# EAGLE design Power_Buggy_4Coil_V1.1 (EAGLE 9.2.2)
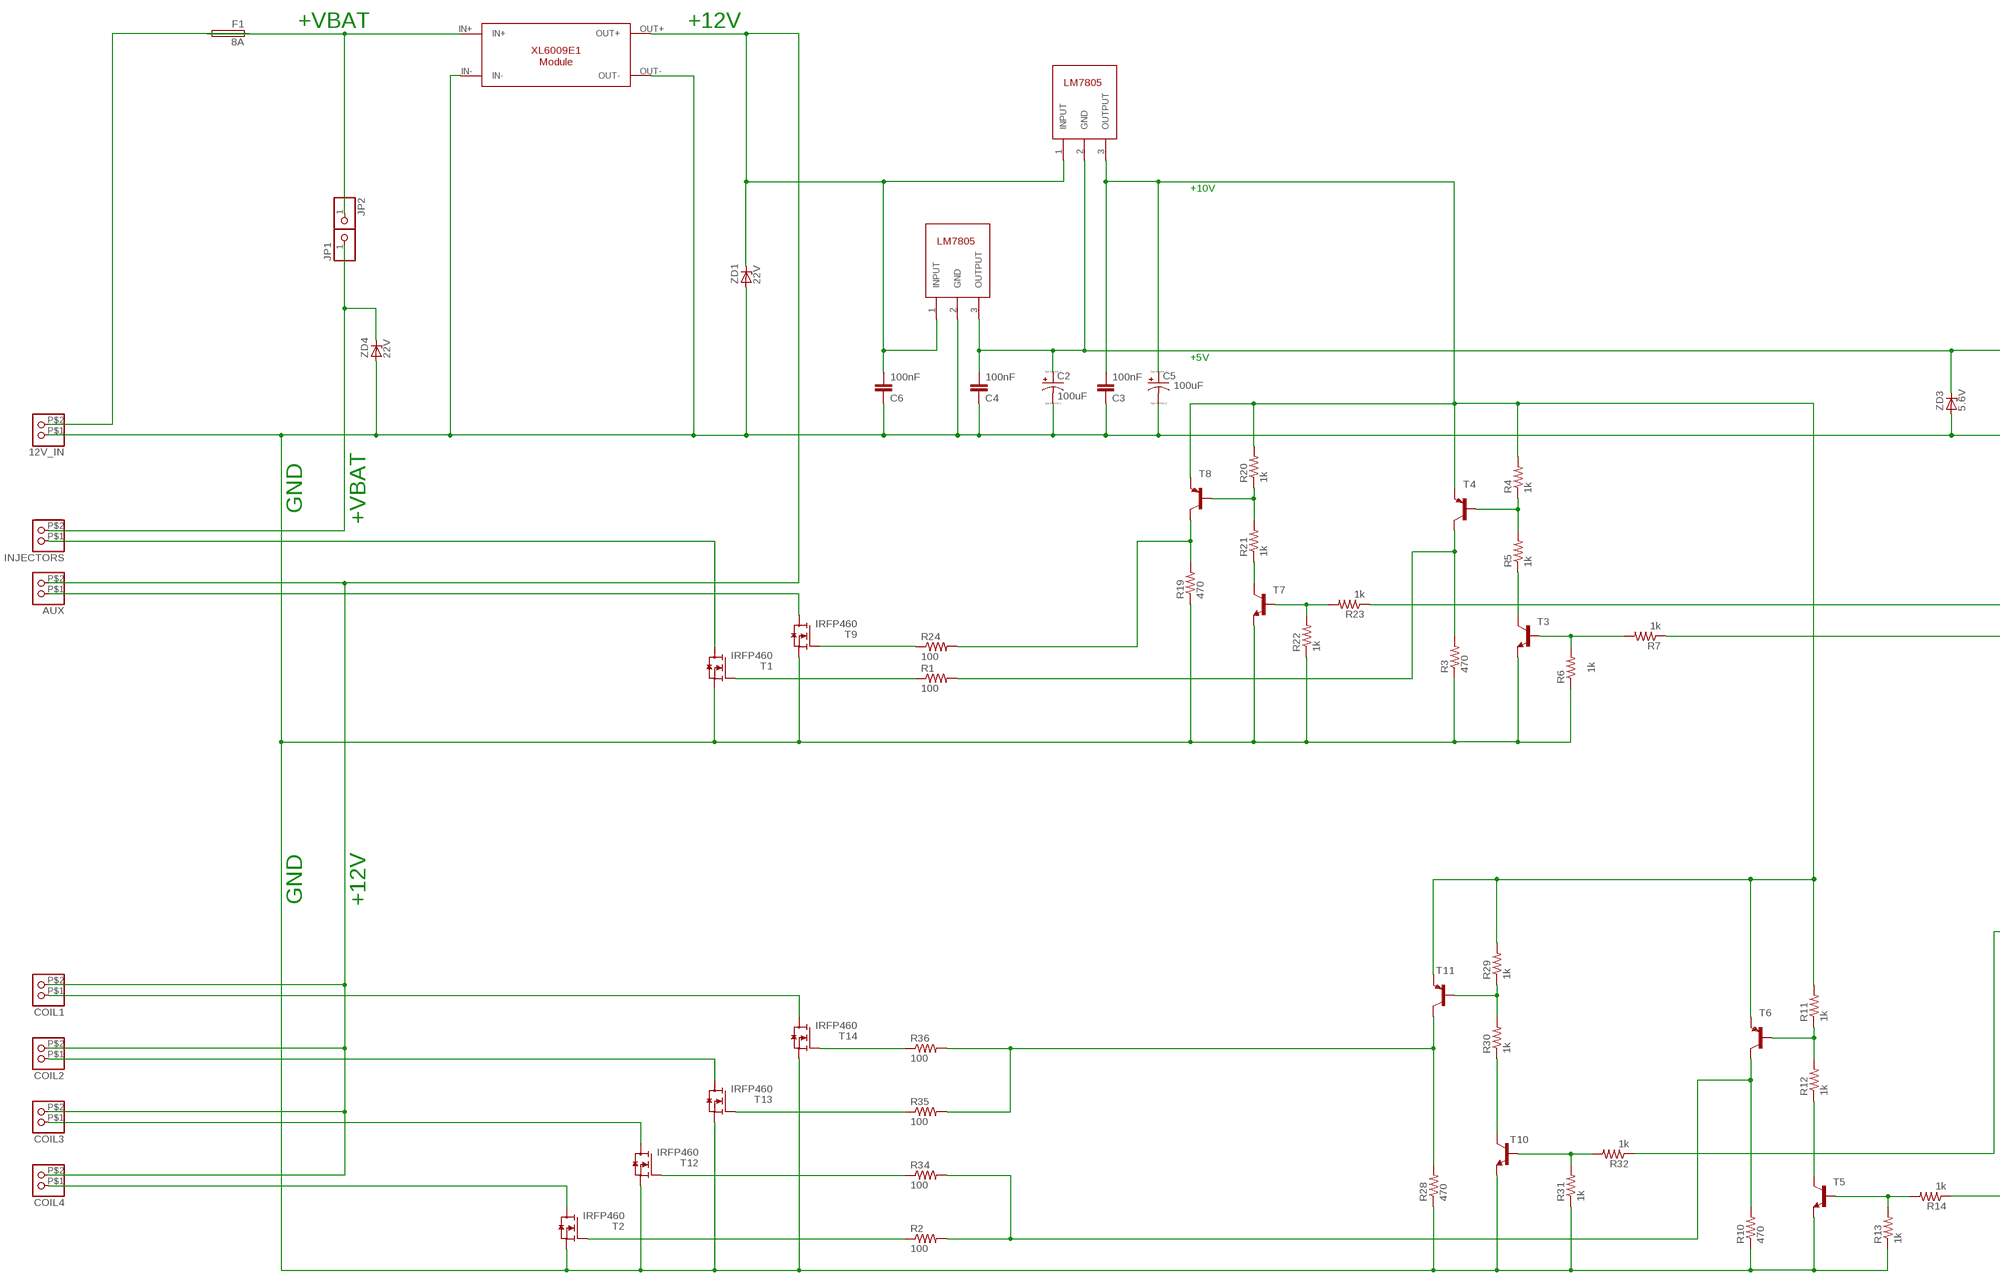
[diagram p0: schematic, sheet 1, part 1 of 2]
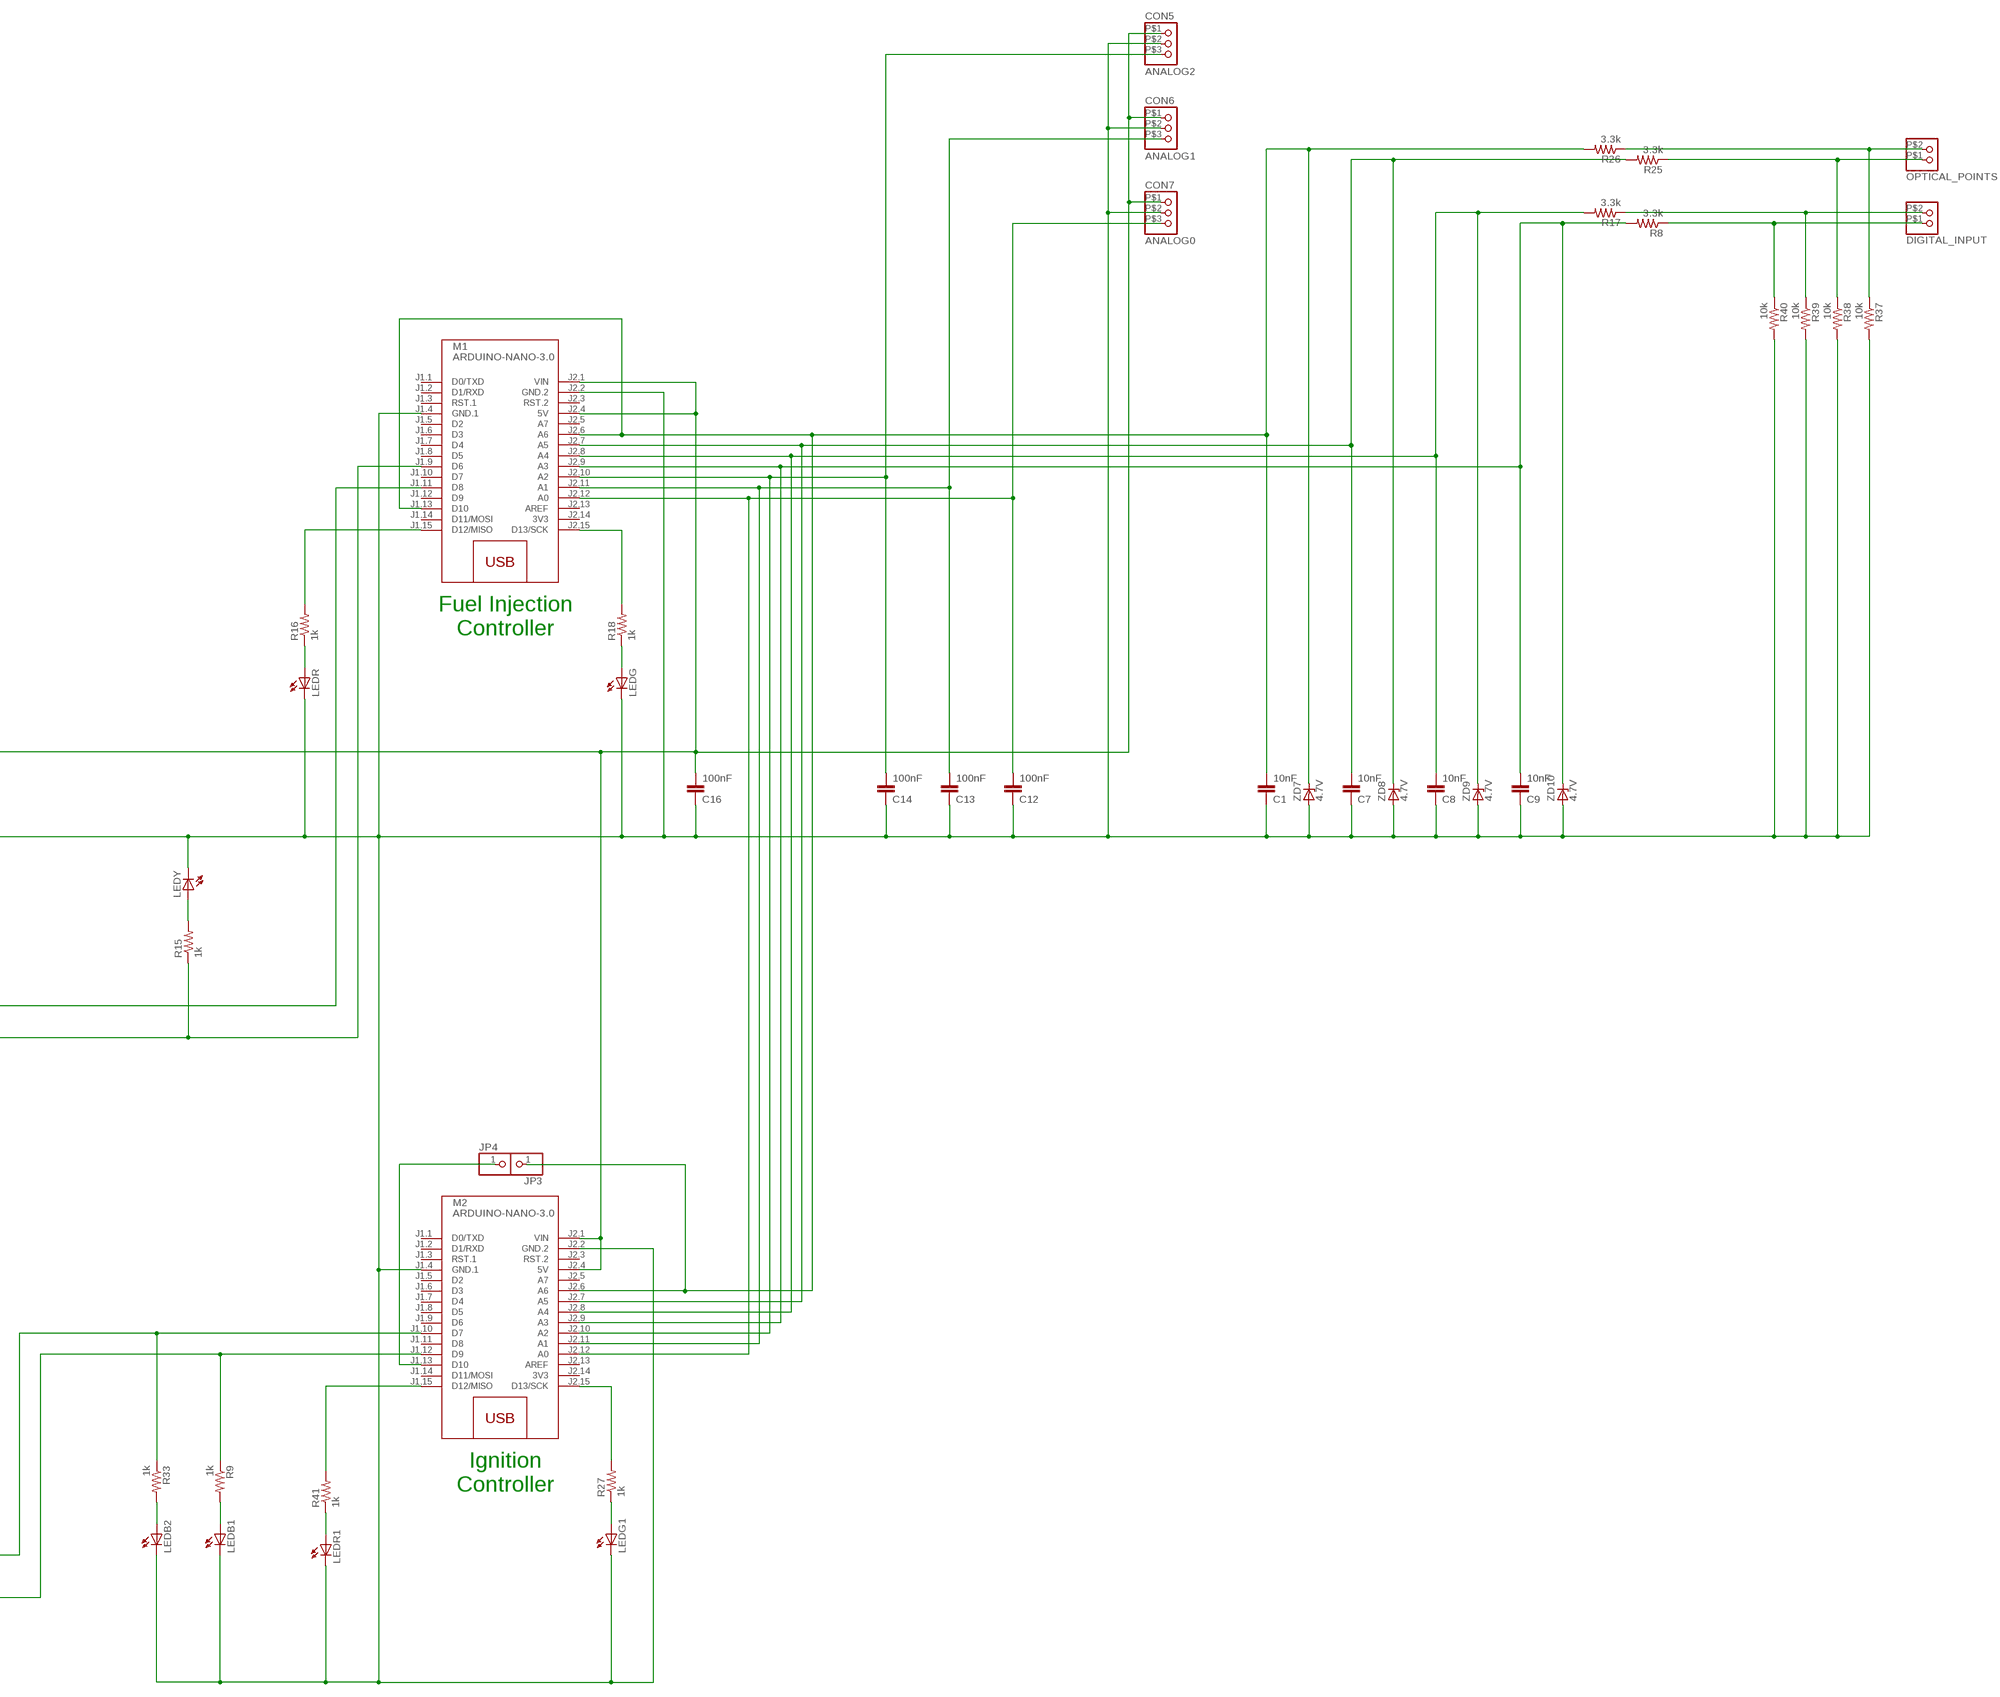
[diagram p1: schematic, sheet 1, part 2 of 2]

## Parts
12V_IN  EBBA-02-C-SS-BU  [EBBA-02-C-SS-BU]
AUX  EBBA-02-C-SS-BU  [EBBA-02-C-SS-BU]
C1  10nF  C-EU050-025X075  [C050-025X075]
C2  100uF  CPOL-USE2-5  [E2-5]
C3  100nF  C-EU050-025X075  [C050-025X075]
C4  100nF  C-EU050-025X075  [C050-025X075]
C5  100uF  CPOL-USE2-5  [E2-5]
C6  100nF  C-EU050-025X075  [C050-025X075]
C7  10nF  C-EU050-025X075  [C050-025X075]
C8  10nF  C-EU050-025X075  [C050-025X075]
C9  10nF  C-EU050-025X075  [C050-025X075]
C12  100nF  C-EU050-025X075  [C050-025X075]
C13  100nF  C-EU050-025X075  [C050-025X075]
C14  100nF  C-EU050-025X075  [C050-025X075]
C16  100nF  C-EU050-025X075  [C050-025X075]
COIL1  EBBA-02-C-SS-BU  [EBBA-02-C-SS-BU]
COIL2  EBBA-02-C-SS-BU  [EBBA-02-C-SS-BU]
COIL3  EBBA-02-C-SS-BU  [EBBA-02-C-SS-BU]
COIL4  EBBA-02-C-SS-BU  [EBBA-02-C-SS-BU]
CON5  ANALOG2  2.0MM_X3  [2.0MM_X3]
CON6  ANALOG1  2.0MM_X3  [2.0MM_X3]
CON7  ANALOG0  2.0MM_X3  [2.0MM_X3]
DIGITAL_INPUT  EBBA-02-C-SS-BU  [EBBA-02-C-SS-BU]
F1  8A  GSH15  [GSH15]
INJECTORS  EBBA-02-C-SS-BU  [EBBA-02-C-SS-BU]
JP1  PINHD-1X1  [1X01]
JP2  PINHD-1X1  [1X01]
JP3  PINHD-1X1  [1X01]
JP4  PINHD-1X1  [1X01]
LEDB1  LED3MM  [LED3MM]
LEDB2  LED3MM  [LED3MM]
LEDG  LED3MM  [LED3MM]
LEDG1  LED3MM  [LED3MM]
LEDR  LED3MM  [LED3MM]
LEDR1  LED3MM  [LED3MM]
LEDY  LED3MM  [LED3MM]
M1  ARDUINO-NANO-3.0  [ARDUINO-NANO-3.0]
M2  ARDUINO-NANO-3.0  [ARDUINO-NANO-3.0]
OPTICAL_POINTS  EBBA-02-C-SS-BU  [EBBA-02-C-SS-BU]
R1  100  R-US_0207/10  [0207/10]
R2  100  R-US_0207/10  [0207/10]
R3  470  R-US_0207/10  [0207/10]
R4  1k  R-US_0207/10  [0207/10]
R5  1k  R-US_0207/10  [0207/10]
R6  1k  R-US_0207/10  [0207/10]
R7  1k  R-US_0207/10  [0207/10]
R8  3.3k  R-US_0207/10  [0207/10]
R9  1k  R-US_0207/10  [0207/10]
R10  470  R-US_0207/10  [0207/10]
R11  1k  R-US_0207/10  [0207/10]
R12  1k  R-US_0207/10  [0207/10]
R13  1k  R-US_0207/10  [0207/10]
R14  1k  R-US_0207/10  [0207/10]
R15  1k  R-US_0207/10  [0207/10]
R16  1k  R-US_0207/10  [0207/10]
R17  3.3k  R-US_0207/10  [0207/10]
R18  1k  R-US_0207/10  [0207/10]
R19  470  R-US_0207/10  [0207/10]
R20  1k  R-US_0207/10  [0207/10]
R21  1k  R-US_0207/10  [0207/10]
R22  1k  R-US_0207/10  [0207/10]
R23  1k  R-US_0207/10  [0207/10]
R24  100  R-US_0207/10  [0207/10]
R25  3.3k  R-US_0207/10  [0207/10]
R26  3.3k  R-US_0207/10  [0207/10]
R27  1k  R-US_0207/10  [0207/10]
R28  470  R-US_0207/10  [0207/10]
R29  1k  R-US_0207/10  [0207/10]
R30  1k  R-US_0207/10  [0207/10]
R31  1k  R-US_0207/10  [0207/10]
R32  1k  R-US_0207/10  [0207/10]
R33  1k  R-US_0207/10  [0207/10]
R34  100  R-US_0207/10  [0207/10]
R35  100  R-US_0207/10  [0207/10]
R36  100  R-US_0207/10  [0207/10]
R37  10k  R-US_0207/10  [0207/10]
R38  10k  R-US_0207/10  [0207/10]
R39  10k  R-US_0207/10  [0207/10]
R40  10k  R-US_0207/10  [0207/10]
R41  1k  R-US_0207/10  [0207/10]
REG1  LM7805_VERT  [TO220_VERT]
REG2  LM7805_VERT  [TO220_VERT]
T1  IRFP460  MOSFET_VERT  [TO-247_HORIZONTAL]
T2  IRFP460  MOSFET_VERT  [TO-247_HORIZONTAL]
T3  -NPN-TO92-EBC  [TO92-EBC]
T4  BCX58-PNP-TO92-EBC  [TO92-EBC]
T5  -NPN-TO92-EBC  [TO92-EBC]
T6  BCX58-PNP-TO92-EBC  [TO92-EBC]
T7  -NPN-TO92-EBC  [TO92-EBC]
T8  BCX58-PNP-TO92-EBC  [TO92-EBC]
T9  IRFP460  MOSFET_VERT  [TO-247_HORIZONTAL]
T10  -NPN-TO92-EBC  [TO92-EBC]
T11  BCX58-PNP-TO92-EBC  [TO92-EBC]
T12  IRFP460  MOSFET_VERT  [TO-247_HORIZONTAL]
T13  IRFP460  MOSFET_VERT  [TO-247_HORIZONTAL]
T14  IRFP460  MOSFET_VERT  [TO-247_HORIZONTAL]
U$2  XL6009E1_MOD  [XL6009E1_MOD]
ZD1  22V  1N5333  [C1702-15]
ZD3  5.6V  1N5333  [C1702-15]
ZD4  22V  1N5333  [C1702-15]
ZD7  4.7V  1N4728  [DO41Z10]
ZD8  4.7V  1N4728  [DO41Z10]
ZD9  4.7V  1N4728  [DO41Z10]
ZD10  4.7V  1N4728  [DO41Z10]

## Nets
N$1: R19.2 R24.2 T8.C
N$2: AUX.P$2 C6.2 COIL1.P$2 COIL2.P$2 COIL3.P$2 COIL4.P$2 REG1.1(INPUT) REG2.1(INPUT) U$2.OUT+ ZD1.C
N$3: 12V_IN.P$1 C1.1 C2.- C3.1 C4.1 C5.- C6.1 C7.1 C8.1 C9.1 C12.1 C13.1 C14.1 C16.1 CON5.P$2 CON6.P$2 CON7.P$2 LEDB1.K(C) LEDB2.K(C) LEDG1.K(C) LEDG.K(C) LEDR1.K(C) LEDR.K(C) LEDY.K(C) M1.J1.4(GND.1) M1.J2.2(GND.2) M2.J1.4(GND.1) M2.J2.2(GND.2) R3.1 R6.1 R10.1 R13.1 R19.1 R22.1 R28.1 R31.1 R37.2 R38.2 R39.2 R40.2 REG1.2(GND) T1.S T2.S T3.E T5.E T7.E T9.S T10.E T12.S T13.S T14.S U$2.IN- U$2.OUT- ZD1.A ZD3.A ZD4.A ZD7.A ZD8.A ZD9.A ZD10.A
N$4: C2.+ C4.2 C16.2 CON5.P$1 CON6.P$1 CON7.P$1 M1.J2.1(VIN) M1.J2.4(5V) M2.J2.1(VIN) M2.J2.4(5V) REG1.3(OUTPUT) REG2.2(GND) ZD3.C
N$5: INJECTORS.P$1 T1.D
N$6: C3.2 C5.+ R4.2 R11.2 R20.2 R29.2 REG2.3(OUTPUT) T4.E T6.E T8.E T11.E
N$7: R28.2 R35.2 R36.2 T11.C
N$8: R2.1 T2.G
N$9: R1.1 T1.G
N$10: R1.2 R3.2 T4.C
N$11: R5.1 T3.C
N$12: R6.2 R7.2 T3.B
N$13: R4.1 R5.2 T4.B
N$14: M1.J1.9(D6) R7.1 R15.1
N$15: R20.1 R21.2 T8.B
N$16: R29.1 R30.2 T11.B
N$17: INJECTORS.P$2 JP1.1 ZD4.C
N$18: F1.2 JP2.1 U$2.IN+
N$19: R2.2 R10.2 R34.2 T6.C
N$20: M1.J1.15(D12/MISO) R16.2
N$21: R11.1 R12.2 T6.B
N$22: 12V_IN.P$2 F1.1
N$23: R12.1 T5.C
N$24: LEDR.A R16.1
N$25: M1.J2.15(D13/SCK) R18.2
N$26: LEDG.A R18.1
N$27: C9.2 M1.J2.9(A3) M2.J2.9(A3) R8.2 ZD10.C
N$28: OPTICAL_POINTS.P$1 R25.1 R38.1
N$29: LEDY.A R15.2
N$30: LEDB1.A R9.2
N$31: R21.1 T7.C
N$33: R22.2 R23.2 T7.B
N$34: C12.2 CON7.P$3 M1.J2.12(A0) M2.J2.12(A0)
N$35: R13.2 R14.2 T5.B
N$36: M1.J1.11(D8) R23.1
N$37: C13.2 CON6.P$3 M1.J2.11(A1) M2.J2.11(A1)
N$38: R24.1 T9.G
N$39: AUX.P$1 T9.D
N$40: C8.2 M1.J2.8(A4) M2.J2.8(A4) R17.2 ZD9.C
N$41: C7.2 M1.J2.7(A5) M2.J2.7(A5) R25.2 ZD8.C
N$42: C1.2 JP3.1 M1.J1.13(D10) M1.J2.6(A6) M2.J2.6(A6) R26.2 ZD7.C
N$43: OPTICAL_POINTS.P$2 R26.1 R37.1
N$44: DIGITAL_INPUT.P$1 R8.1 R40.1
N$45: DIGITAL_INPUT.P$2 R17.1 R39.1
N$46: M2.J2.15(D13/SCK) R27.2
N$47: LEDG1.A R27.1
N$48: R30.1 T10.C
N$49: R31.2 R32.2 T10.B
N$50: C14.2 CON5.P$3 M1.J2.10(A2) M2.J2.10(A2)
N$51: M2.J1.10(D7) R32.1 R33.1
N$52: LEDB2.A R33.2
N$53: M2.J1.12(D9) R9.1 R14.1
N$54: R34.1 T12.G
N$55: R35.1 T13.G
N$56: R36.1 T14.G
N$57: COIL4.P$1 T2.D
N$58: COIL3.P$1 T12.D
N$59: COIL2.P$1 T13.D
N$60: COIL1.P$1 T14.D
N$61: M2.J1.15(D12/MISO) R41.2
N$62: LEDR1.A R41.1
N$63: JP4.1 M2.J1.13(D10)
Unconnected: M1.J1.1(D0/TXD) M1.J1.2(D1/RXD) M1.J1.3(RST.1) M1.J1.5(D2) M1.J1.6(D3) M1.J1.7(D4) M1.J1.8(D5) M1.J1.10(D7) M1.J1.12(D9) M1.J1.14(D11/MOSI) M1.J2.3(RST.2) M1.J2.5(A7) M1.J2.13(AREF) M2.J1.1(D0/TXD) M2.J1.2(D1/RXD) M2.J1.3(RST.1) M2.J1.5(D2) M2.J1.6(D3) M2.J1.7(D4) M2.J1.8(D5) M2.J1.9(D6) M2.J1.11(D8) M2.J1.14(D11/MOSI) M2.J2.3(RST.2) M2.J2.5(A7) M2.J2.13(AREF)

## Notes on the sheet
- +VBAT | +12V
- +10V
- Fuel Injection
  Controller
- +5V
- GND | +VBAT
- GND | +12V
- Ignition
  Controller

## Power pins joined to a net without a drawn wire
3V3: M1.J2.14(3V3) M2.J2.14(3V3)

## Library data of the parts
12V_IN AUX COIL1-COIL4 DIGITAL_INPUT INJECTORS OPTICAL_POINTS = Portable_Cal_Parts_SM:EBBA-02-C-SS-BU
C1 C3 C4 C6-C9 C12-C14 C16 = resistor:C-EU: CAPACITOR, European symbol
C2 C5 = resistor:CPOL-US: POLARIZED CAPACITOR, American symbol
CON5-CON7 = Power_Buggy_Parts:2.0MM_X3
F1 = fuse:GSH15: FUSE HOLDER grid 15mm, 19649 Wickmann; MPN: 64900001039; OC_FARNELL: 1271673; OC_NEWARK: 02P0318
JP1-JP4 = pinhead:PINHD-1X1: PIN HEADER
LEDB1 LEDB2 LEDG LEDG1 LEDR LEDR1 LEDY = led:LED: LED OSRAM: - CHIPLED LG R971, LG N971, LY N971, LG Q971, LY Q971, LO R971, LY R971 LH N974, LH R974 LS Q976, LO Q976, LY Q976 LO Q996 - Hyper CHIPLED LW Q18S LB Q993, LB Q99A, LB R99A - SideLED LS A670, LO A670, LY A670, LG A670, LP A670 LB A673, LV A673, LT A673, LW A673 LH A674 LY A675 LS A676, LA A676, LO A676, LY A676, LW A676 LS A679, LY A679, LG A679 - Hyper Micro SIDELED® LS Y876, LA Y876, LO Y876, LY Y876 LT Y87S - SmartLED LW L88C, LW L88S LB L89C, LB L89S, LG L890 LS L89K, LO L89K, LY L89K LS L896, LA L896, LO L896, LY L896 - TOPLED LS T670, LO T670, LY T670, LG T670, LP T670 LSG T670, LSP T670, LSY T670, LOP T670, LYG T670 LG T671, LOG T671, LSG T671 LB T673, LV T673, LT T673, LW T673 LH T674 LS T676, LA T676, LO T676, LY T676, LB T676, LH T676, LSB T676, LW T676 LB T67C, LV T67C, LT T67C, LS T67K, LO T67K, LY T67K, LW E67C LS E67B, LA E67B, LO E67B, LY E67B, LB E67C, LV E67C, LT E67C LW T67C LS T679, LY T679, LG T679 LS T770, LO T770, LY T770, LG T770, LP T770 LB T773, LV T773, LT T773, LW T773 LH T774 LS E675, LA E675, LY E675, LS T675 LS T776, LA T776, LO T776, LY T776, LB T776 LHGB T686 LT T68C, LB T68C - Hyper Mini TOPLED® LB M676 - Mini TOPLED Santana® LG M470 LS M47K, LO M47K, LY M47K Source: http://www.osram.convergy.de LUXEON: - LUMILED® LXK2-PW12-R00, LXK2-PW12-S00, LXK2-PW14-U00, LXK2-PW14-V00 LXK2-PM12-R00, LXK2-PM12-S00, LXK2-PM14-U00 LXK2-PE12-Q00, LXK2-PE12-R00, LXK2-PE12-S00, LXK2-PE14-T00, LXK2-PE14-U00 LXK2-PB12-K00, LXK2-PB12-L00, LXK2-PB12-M00, LXK2-PB14-N00, LXK2-PB14-P00, LXK2-PB14-Q00 LXK2-PR12-L00, LXK2-PR12-M00, LXK2-PR14-Q00, LXK2-PR14-R00 LXK2-PD12-Q00, LXK2-PD12-R00, LXK2-PD12-S00 LXK2-PH12-R00, LXK2-PH12-S00 LXK2-PL12-P00, LXK2-PL12-Q00, LXK2-PL12-R00 Source: www.luxeon.com KINGBRIGHT: KA-3528ASYC Source: www.kingbright.com
M1 M2 = diy-modules:ARDUINO-NANO-3.0: Arduino Nano 3.0
R1-R41 = resistor:R-US_: RESISTOR, American symbol
REG1 REG2 = Portable_Cal_Parts_SM:LM7805_VERT
T1 T2 T9 T12-T14 = Inverter_Parts:MOSFET_VERT
T3 T5 T7 T10 = transistor-neu-to92:*-NPN-: NPN Transistror
T4 T6 T8 T11 = transistor:*-PNP-: PNP Transistror
U$2 = Power_Buggy_Parts:XL6009E1_MOD
ZD1 ZD3 ZD4 = diode:1N5333: Z DIODE 3.3 V, 5W, 5 percent (Motorola)
ZD7-ZD10 = diode:1N4728: Z DIODE 3.3 V, 1W, 5 percent

## Board
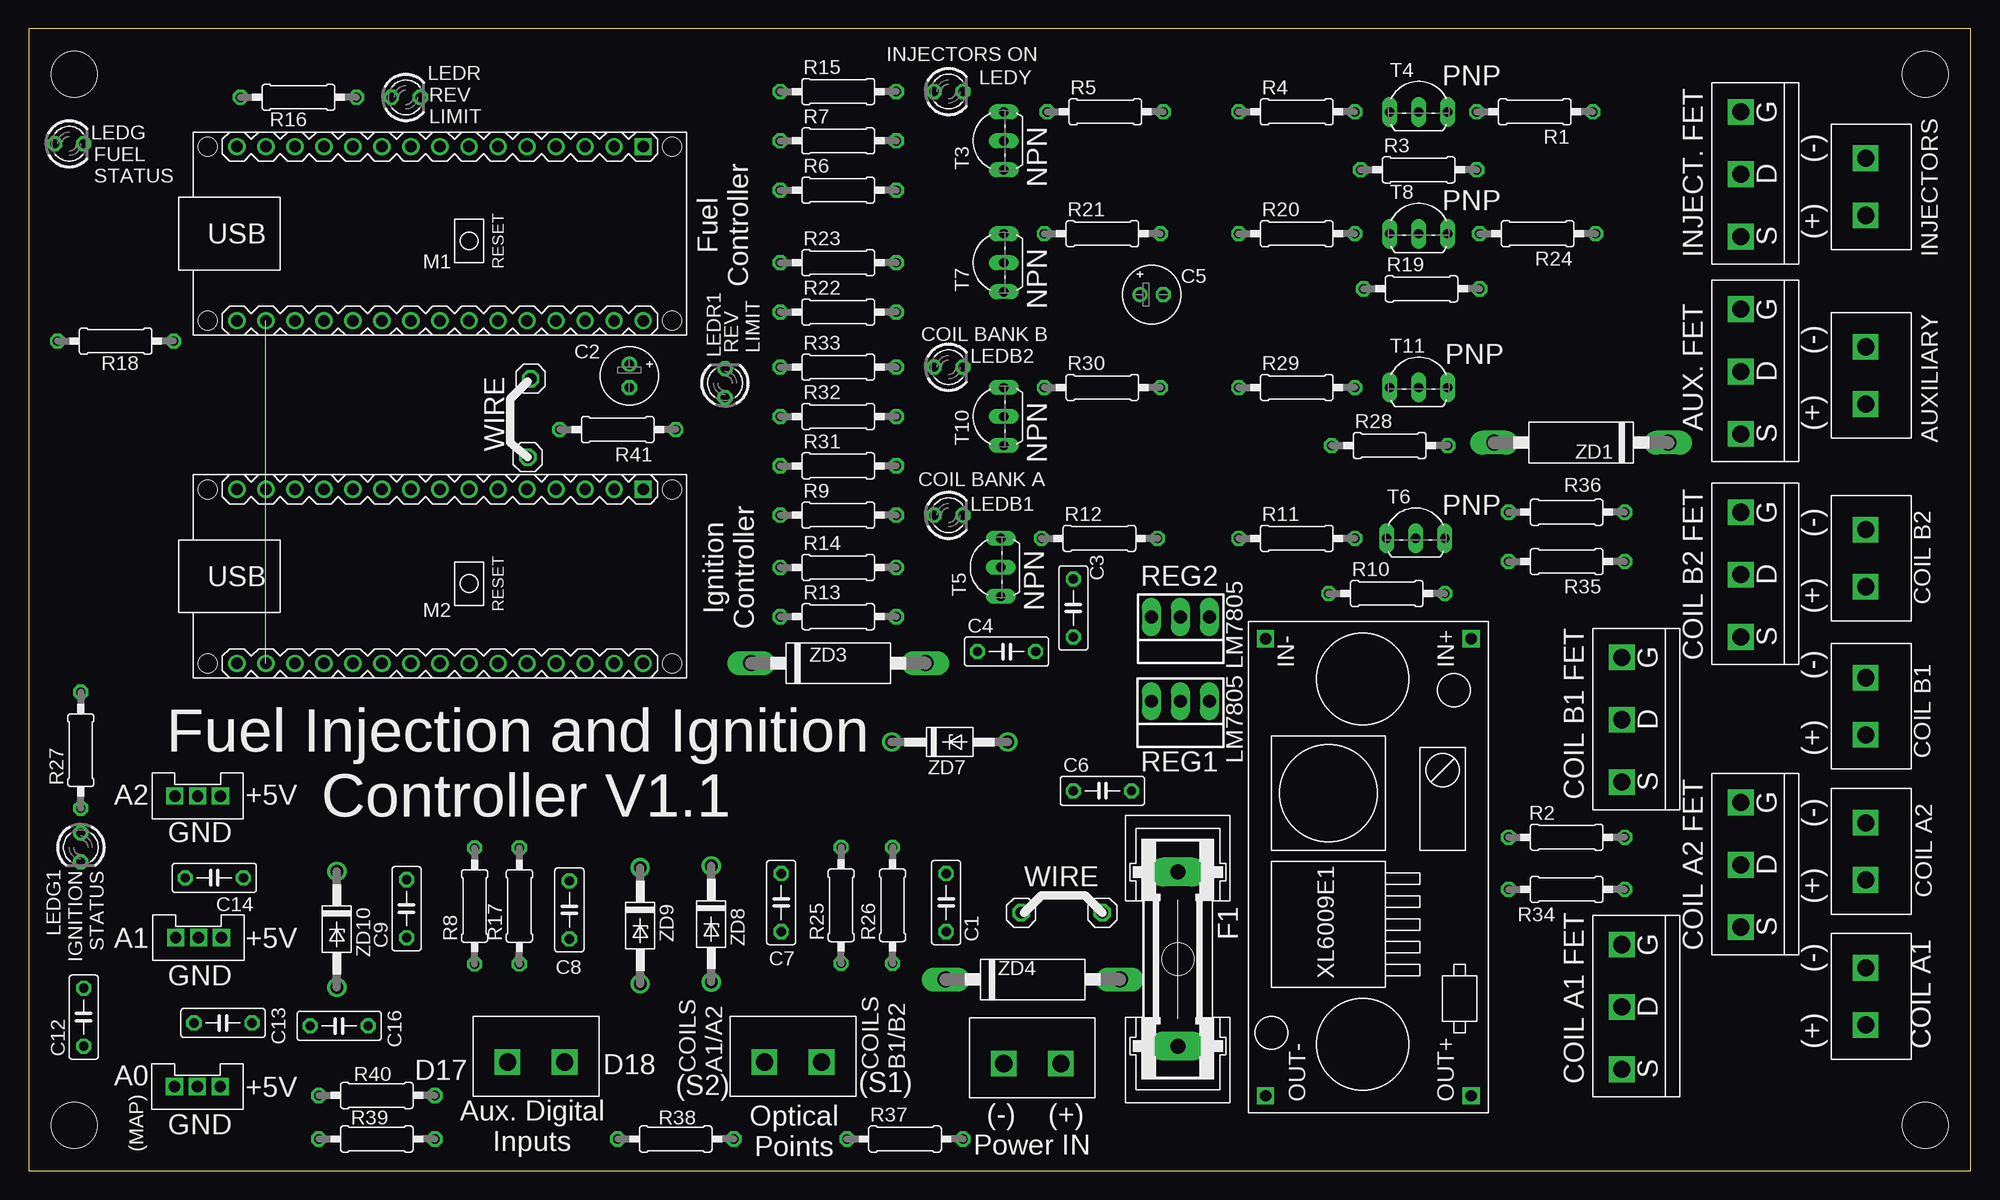
[diagram p2: board, top side]
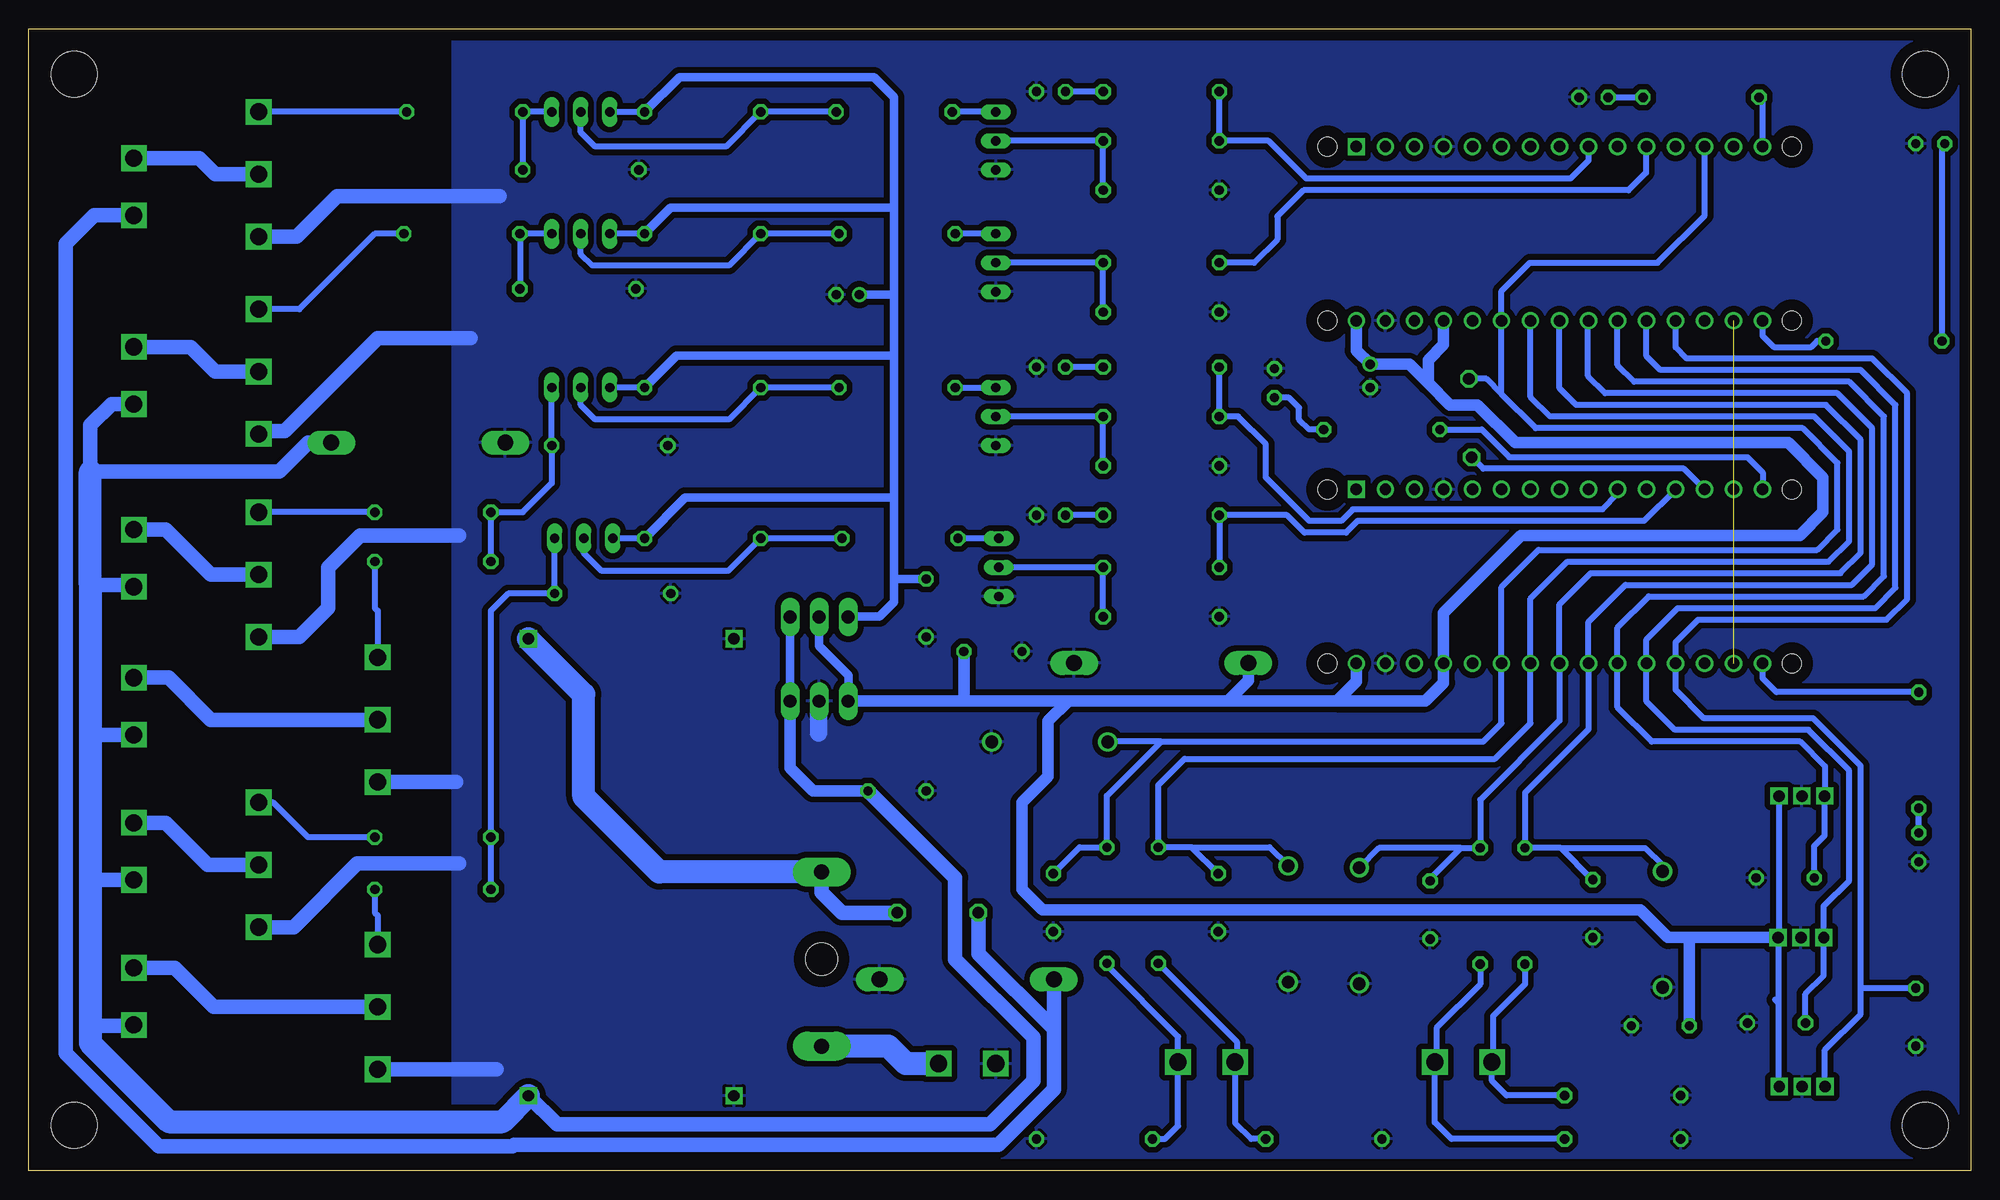
[diagram p3: board, bottom side, seen from below]

Size 170 x 100 mm. Coordinates in mm from the lower left corner, seen from the top.
Outline: 0,0 170,0 170,100 0,100 0,0
Copper layers 16: Bottom 0.035mm
Design rules "default *": minimum track width 6mil, minimum drill 0.35mm, track to track 20mil, track to pad 20mil, pad to pad 20mil, via to via 20mil, smd to smd 6mil, copper to edge 40mil, drill to drill 6mil, minimum pad ring 10mil, minimum via ring 8mil, stop-mask expansion 4mil, vias tented up to drill 0mil, thermal gap 10mil
Holes 4 mm at 166,96 4,96 4,4 166,4

### Footprints (pad centres in the part's own frame; a part is rotated, then mirrored left to right if it is on the bottom)
EBBA-02-C-SS-BU = drill 1.5 square: P$1 0,0; P$2 5,0
C050-025X075 = drill 0.813 octagon: 1 -2.54,0; 2 2.54,0
E2-5 = drill 0.813 pad 1.27: + -1.016,0 | drill 0.813 pad 1.27 octagon: - 1.016,0
2.0MM_X3 = drill 1 square: P$1 -2,0; P$2 0,0; P$3 2,0
GSH15 = drill 1.321 pad 2.54 long: 1 -7.62,0; 2 7.62,0 | hole 2.794: 0,0
1X01 = drill 1.016 octagon: 1 0,0
LED3MM = drill 0.813 octagon: A -1.27,0; K 1.27,0
ARDUINO-NANO-3.0 = drill 1 square: J1.1 17.78,7.62 | drill 1: J1.2 15.24,7.62; J1.3 12.7,7.62; J1.4 10.16,7.62; J1.5 7.62,7.62; J1.6 5.08,7.62; J1.7 2.54,7.62; J1.8 0,7.62; J1.9 -2.54,7.62; J1.10 -5.08,7.62; J1.11 -7.62,7.62; J1.12 -10.16,7.62; J1.13 -12.7,7.62; J1.14 -15.24,7.62; J1.15 -17.78,7.62; J2.1 17.78,-7.62; J2.2 15.24,-7.62; J2.3 12.7,-7.62; J2.4 10.16,-7.62; J2.5 7.62,-7.62; J2.6 5.08,-7.62; J2.7 2.54,-7.62; J2.8 0,-7.62; J2.9 -2.54,-7.62; J2.10 -5.08,-7.62; J2.11 -7.62,-7.62; J2.12 -10.16,-7.62; J2.13 -12.7,-7.62; J2.14 -15.24,-7.62; J2.15 -17.78,-7.62 | hole 1.651: -20.32,7.62; -20.32,-7.62; 20.32,-7.62; 20.32,7.62
0207/10 = drill 0.813 octagon: 1 -5.08,0; 2 5.08,0
TO220_VERT = drill 1.118 long: 1 -2.51,0.28; 2 0.03,0.28; 3 2.57,0.28
TO-247_HORIZONTAL = drill 1.5 square: D 5.46,0; G 0,0; S 10.92,0
TO92-EBC = drill 0.813 long: B 0,-1.27; C 2.54,-1.27; E -2.54,-1.27
XL6009E1_MOD = drill 1 square: IN+ 41.5,1.5; IN- 41.5,19.5; OUT+ 1.5,1.5; OUT- 1.5,19.5
C1702-15 = drill 1.397 long: A 7.62,0; C -7.62,0
DO41Z10 = drill 1.118: A 5.08,0; C -5.08,0

### Placement (x,y rotation side)
12V_IN  85.34,9.4 0 top
AUX  160.78,72.14 270 top
C1  80.31,23.49 90 top
C2  52.58,69.6 270 top
C3  91.44,49.28 90 top
C4  85.6,45.47 0 top
C5  98.3,76.71 0 top
C6  93.98,33.27 0 top
C7  65.87,23.49 90 top
C8  47.33,22.85 90 top
C9  33.09,22.96 90 top
C12  4.83,13.46 90 top
C13  17.02,12.95 180 top
C14  16.26,25.65 180 top
C16  27.18,12.7 180 top
COIL1  160.78,56.13 270 top
COIL2  160.78,43.18 270 top
COIL3  160.78,17.78 270 top
COIL4  160.78,30.48 270 top
CON5  14.8,32.82 180 top
CON6  14.88,20.43 180 top
CON7  14.77,7.39 180 top
DIGITAL_INPUT  41.92,9.53 0 top
F1  100.58,18.54 90 top
INJECTORS  160.78,88.65 270 top
JP1  86.87,22.61 0 top
JP2  93.98,22.61 0 top
JP3  43.94,69.34 0 top
JP4  43.69,62.48 0 top
LEDB1  80.52,57.4 0 top
LEDB2  80.52,70.36 0 top
LEDG  3.56,89.92 0 top
LEDG1  4.57,28.32 270 top
LEDR  33.02,93.98 0 top
LEDR1  60.96,68.96 90 top
LEDY  80.52,94.49 0 top
M1  36.01,82.05 0 top
M2  36.01,52.05 0 top
OPTICAL_POINTS  64.4,9.53 0 top
R1  131.83,92.71 180 top
R2  134.62,29.21 180 top
R3  121.67,87.63 0 top
R4  111,92.71 0 top
R5  94.23,92.71 0 top
R6  70.87,85.85 0 top
R7  70.87,90.17 0 top
R8  39.04,23.2 90 top
R9  70.87,57.4 0 top
R10  118.87,50.55 0 top
R11  111,55.37 0 top
R12  93.73,55.37 0 top
R13  70.87,48.51 0 top
R14  70.87,52.83 0 top
R15  70.87,94.49 0 top
R16  23.62,93.98 180 top
R17  42.96,23.2 90 top
R18  7.62,72.64 0 top
R19  121.92,77.22 0 top
R20  111,82.04 0 top
R21  93.98,82.04 0 top
R22  70.87,75.18 0 top
R23  70.87,79.5 0 top
R24  132.08,82.04 180 top
R25  71.12,23.25 90 top
R26  75.62,23.25 90 top
R27  4.57,36.83 90 top
R28  119.13,63.5 0 top
R29  111,68.58 0 top
R30  93.98,68.58 0 top
R31  70.87,61.72 0 top
R32  70.87,66.04 0 top
R33  70.87,70.36 0 top
R34  134.62,24.64 180 top
R35  134.62,53.34 180 top
R36  134.62,57.66 180 top
R37  76.71,2.79 0 top
R38  56.64,2.79 180 top
R39  30.48,2.79 180 top
R40  30.48,6.6 180 top
R41  51.56,64.9 180 top
REG1  100.84,41.4 180 top
REG2  100.84,48.77 180 top
T1  149.86,92.71 270 top
T2  149.86,32.26 270 top
T3  84.07,90.17 90 top
T4  121.67,93.98 0 top
T5  83.82,52.83 90 top
T6  121.41,56.64 0 top
T7  84.07,79.5 90 top
T8  121.67,83.31 0 top
T9  149.86,75.44 270 top
T10  84.07,66.04 90 top
T11  121.67,69.85 0 top
T12  139.45,19.81 270 top
T13  139.45,44.96 270 top
T14  149.86,57.66 270 top
U$2  127.76,5.08 90 top
ZD1  135.89,63.75 180 top
ZD3  70.87,44.45 0 top
ZD4  87.88,16.76 0 top
ZD7  80.62,37.54 0 top
ZD8  59.75,21.61 270 top
ZD9  53.53,21.47 270 top
ZD10  26.98,21.15 270 top

### Tracks (layer width: path | path; a pad name or v marks a point on that pad's centre or on a via)
3V3  (1 unrouted)
N$1
  Bottom 0.508: T8.C R24.2 R19.2
N$2
  Bottom 0.762: REG1.1 REG2.1
  Bottom 1.016: C6.2 101.35,33.27 103.35,35.28 REG1.1
  Bottom 1.27: AUX.P$2 162.73,67.14 164.59,65.28 164.59,61.21 148.08,61.21 145.54,63.75 ZD1.C | COIL1.P$2 160.96,51.31 164.59,51.31 | COIL4.P$2 164.51,25.48 164.59,25.4 | COIL2.P$2 164.42,38.18 164.59,38.35 | COIL3.P$2 160.86,12.7 164.59,12.7 | U$2.OUT+ 123.75,4.06 85.85,4.06 82.04,7.87 82.04,11.68 88.9,18.54 88.9,25.65 C6.2
  Bottom 2.032: 164.59,61.21 164.59,51.31 164.59,38.35 164.59,25.4 164.59,12.7 164.59,11.18 157.73,4.32 128.52,4.32 U$2.OUT+
N$3
  Bottom 1.27: T14.S 146.3,46.74 143.76,49.28 143.76,52.83 140.97,55.63 132.33,55.63 | T13.S 133.86,34.04 133.85,34.04 132.59,34.04 | T12.S 134.11,8.89 | 134.11,8.89 | T2.S 146.81,21.34 141.22,26.92 132.33,26.92 | T9.S 149.61,64.77 147.57,64.77 139.45,72.9 131.32,72.9 | T1.S 146.56,81.79 143,85.34 128.78,85.34 | 134.11,8.89 129.03,8.89
  Bottom 1.524: REG1.2 100.84,41.09 100.84,38.35
  pour Bottom: 0,100 132.94,100 132.94,0 0,0
N$4
  Bottom 0.508: CON5.P$1 16.8,20.51 CON6.P$1 16.88,14.73 | 16.88,14.73 16.88,7.5 CON7.P$1 | 17.13,14.99 16.88,14.73
  Bottom 0.762: REG2.2 100.81,45.94 98.24,43.38 98.24,41.15
  Bottom 1.016: CON6.P$1 24.64,20.43 | 24.64,20.43 26.53,20.43 28.96,22.86 81.28,22.86 83.06,24.64 83.06,32.26 80.77,34.54 80.77,39.37 78.99,41.15 | 24.64,20.43 C16.2 | M2.J2.1 53.79,42.86 55.5,41.15 | 55.5,41.15 65.02,41.15 | 65.02,41.15 78.99,41.15 | 55.5,41.15 47.75,41.15 46.17,42.73 M2.J2.4 46.17,48.83 39.37,55.63 14.99,55.63 12.95,57.66 12.95,60.71 16,63.75 39.88,63.75 43.18,67.06 45.59,67.06 47.5,68.96 | M1.J2.4 46.17,72.33 47.5,71 47.5,68.96 | 78.99,41.15 88.14,41.15 | 65.02,41.15 63.25,42.93 ZD3.C | C4.2 88.14,41.15 | 88.14,41.15 98.24,41.15 REG1.3 | M1.J2.1 53.79,71.82 C2.+ 49.15,70.61 47.5,68.96
N$5
  Bottom 1.27: T1.D 153.67,87.25 155.07,88.65 INJECTORS.P$1
N$6
  Bottom 0.508: T4.E R4.2 | R20.2 T8.E | R29.2 T11.E | R11.2 T6.E
  Bottom 0.762: R4.2 113.03,95.76 96.01,95.76 94.23,93.98 94.23,84.33 | 94.23,84.33 94.23,76.96 | 94.23,76.96 94.23,71.37 | 94.23,71.37 94.23,58.93 | R20.2 113.79,84.33 94.23,84.33 | R29.2 113.28,71.37 94.23,71.37 | R11.2 112.52,58.93 94.23,58.93 | C5.+ 94.49,76.71 94.23,76.96 | REG2.3 98.24,48.51 95.5,48.51 94.23,49.78 94.23,51.82 | 94.23,58.93 94.23,51.82 | C3.2 94.23,51.82
N$7
  Bottom 0.508: T11.C R28.2 124.21,60.2 126.75,57.66 R36.2 R35.2
N$8
  Bottom 0.508: R2.1 145.54,29.21 148.59,32.26 T2.G
N$9
  Bottom 0.508: R1.1 T1.G
N$10
  Bottom 0.508: R3.2 R1.2 T4.C
N$11
  Bottom 0.508: T3.C R5.1
N$12
  Bottom 0.508: R6.2 R7.2 T3.B
N$13
  Bottom 0.508: R5.2 R4.1 108.97,89.66 120.4,89.66 121.67,90.93 T4.B
N$14
  Bottom 0.508: M1.J1.9 33.47,88.45 35.05,86.87 58.17,86.87 61.47,90.17 R7.1 R15.1
N$15
  Bottom 0.508: R21.2 R20.1 108.71,79.25 120.65,79.25 121.67,80.26 T8.B
N$16
  Bottom 0.508: R30.2 R29.1 108.71,65.79 120.4,65.79 121.67,67.06 T11.B
N$17
  Bottom 1.27: 80.26,12.42 86.87,19.02 JP1.1 | 80.26,12.42 80.26,7.14 85.12,2.29 127.5,2.29 127.63,2.16 158.62,2.16 166.75,10.29 166.75,81.15 164.26,83.65 INJECTORS.P$2 | ZD4.C 80.26,12.42
N$18
  Bottom 1.27: JP2.1 98.81,22.61 100.58,24.38 F1.2
  Bottom 2.032: U$2.IN+ 121.41,41.73 121.41,32.77 114.81,26.16 F1.2
N$19
  Bottom 0.508: T6.C R10.2 128.02,50.55 129.54,49.02 R2.2 R34.2
N$20
  Bottom 0.508: M1.J1.15 18.23,93.67 R16.2
N$21
  Bottom 0.508: R12.2 R11.1 108.76,52.53 119.84,52.53 121.41,54.1 T6.B
N$22
  Bottom 2.032: 12V_IN.P$2 93.22,9.4 94.74,10.92 F1.1
N$23
  Bottom 0.508: T5.C R12.1
N$24
  Bottom 0.508: LEDR.A R16.1
N$25
  Bottom 0.508: M1.J2.15 18.23,73.09 17.27,72.14 13.97,72.14 13.46,72.64 R18.2
N$26
  Bottom 0.508: LEDG.A 2.54,89.66 R18.1
N$27
  Bottom 0.508: 35.9,28.28 R8.2 39.04,33.1 33.47,38.67 M2.J2.9 33.47,48.07 30.23,51.31 10.41,51.31 8.64,53.09 8.64,65.02 11.68,68.07 32,68.07 33.53,69.6 33.53,74.37 M1.J2.9 | 35.9,28.28 33.12,25.5 C9.2 | 35.9,28.28 28.53,28.28 26.98,26.73 ZD10.C
N$28
  Bottom 0.508: R25.1 64.26,11.31 64.26,9.65 64.38,9.53 | OPTICAL_POINTS.P$1 64.38,9.53 | R38.1 62.99,2.79 64.38,4.18 64.38,9.53
N$29
  Bottom 0.508: R15.2 LEDY.A
N$30
  Bottom 0.508: R9.2 LEDB1.A
N$31
  Bottom 0.508: T7.C R21.1
N$33
  Bottom 0.508: R22.2 R23.2 T7.B
N$34
  Bottom 0.508: CON7.P$3 12.77,10.6 9.65,13.72 9.65,16 | 9.65,16 9.65,35.47 13.8,39.62 23.37,39.62 25.85,42.1 M2.J2.12 25.85,46.29 23.88,48.26 7.37,48.26 5.59,50.04 5.59,68.07 8.64,71.12 24.89,71.12 25.85,72.08 M1.J2.12 | C12.2 9.65,16
N$35
  Bottom 0.508: R13.2 R14.2 T5.B
N$36
  Bottom 0.508: M1.J1.11 28.45,89.61 28.45,87.38 29.97,85.85 58.42,85.85 60.71,83.57 60.71,81.53 62.74,79.5 R23.1
N$37
  Bottom 0.508: C13.2 14.48,15.49 12.88,17.09 CON6.P$3 12.88,23.19 10.67,25.4 10.67,35.05 14.22,38.61 25.91,38.61 28.39,41.09 M2.J2.11 28.39,46.54 25.65,49.28 8.38,49.28 6.6,51.05 6.6,67.06 9.65,70.1 27.18,70.1 28.39,71.31 M1.J2.11
N$38
  Bottom 0.508: R24.1 139.7,82.04 146.3,75.44 T9.G
N$39
  Bottom 1.27: T9.D 153.67,69.98 155.83,72.14 AUX.P$1
N$40
  Bottom 0.508: C8.2 47.33,25.57 44.62,28.28 | 44.62,28.28 R17.2 42.96,32.48 36.01,39.43 M2.J2.8 36.01,49.59 33.27,52.32 11.43,52.32 9.65,54.1 9.65,64.01 12.7,67.06 34.54,67.06 36.01,68.52 M1.J2.8 | 44.62,28.28 51.81,28.28 ZD9.C
N$41
  Bottom 0.508: 68.21,28.33 R25.2 71.12,33.78 68.83,36.07 41.66,36.07 38.55,39.18 M2.J2.7 38.55,50.1 35.31,53.34 12.45,53.34 10.67,55.12 10.67,62.99 13.72,66.04 36.83,66.04 38.55,67.76 M1.J2.7 | 68.21,28.33 65.91,26.03 C7.2 | 68.21,28.33 61.39,28.33 ZD8.C
N$42
  Bottom 0.508: C1.2 78.01,28.33 R26.2 | R26.2 75.62,29.54 | 70.87,37.59 42.67,37.59 41.09,39.18 M2.J2.6 41.09,51.11 37.85,54.36 13.46,54.36 11.68,56.13 11.68,61.98 14.73,65.02 38.1,65.02 41.09,68.01 | R26.2 75.62,32.84 70.87,37.59 | 70.87,37.59 75.49,37.59 ZD7.C | 41.09,68.01 M1.J2.6 41.09,77.02 38.61,79.5 27.43,79.5 23.31,83.63 M1.J1.13 | 41.09,68.01 42.42,69.34 JP3.1
N$43
  Bottom 0.508: R26.1 75.62,17.98 69.4,11.76 OPTICAL_POINTS.P$2 69.4,3.94 70.55,2.79 R37.1
N$44
  Bottom 0.508: R8.1 39.04,16.34 41.83,13.54 41.83,9.62 DIGITAL_INPUT.P$1 41.92,7.88 40.64,6.6 R40.1
N$45
  Bottom 0.508: R17.1 42.96,16.34 46.77,12.53 46.77,9.68 DIGITAL_INPUT.P$2 46.92,4.25 45.47,2.79 R39.1
N$46
  Bottom 0.508: R27.2 17.02,41.91 18.23,43.12 M2.J2.15
N$47
  Bottom 0.508: LEDG1.A R27.1
N$48
  Bottom 0.508: R30.1 T10.C
N$49
  Bottom 0.508: R31.2 R32.2 T10.B
N$50
  Bottom 0.508: C14.2 13.72,28.45 12.8,29.36 CON5.P$3 12.78,32.85 12.78,35.42 14.95,37.59 27.94,37.59 30.93,40.58 M2.J2.10 30.93,47.56 28.19,50.29 9.4,50.29 7.62,52.07 7.62,66.04 10.67,69.09 29.46,69.09 30.93,70.55 M1.J2.10
N$51
  Bottom 0.508: M2.J1.10 30.93,59.24 32.26,57.91 54.1,57.91 55.12,56.9 57.91,56.9 61.72,60.71 61.72,63.63 64.14,66.04 R32.1 R33.1
N$52
  Bottom 0.508: R33.2 LEDB2.A
N$53
  Bottom 0.508: M2.J1.12 28.62,56.9 53.68,56.9 54.7,55.88 58.33,55.88 59.86,57.4 R9.1 R14.1
N$54
  Bottom 0.508: R34.1 139.7,22.61 139.45,22.35 T12.G
N$55
  Bottom 0.508: R35.1 139.7,49.28 139.45,49.02 T13.G
N$56
  Bottom 0.508: R36.1 T14.G
N$57
  Bottom 1.27: COIL4.P$1 157.99,30.48 154.31,26.8 T2.D
N$58
  Bottom 1.27: COIL3.P$1 157.23,17.78 153.8,14.35 T12.D
N$59
  Bottom 1.27: COIL2.P$1 157.73,43.18 154.05,39.5 T13.D
N$60
  Bottom 1.27: COIL1.P$1 157.99,56.13 154.05,52.2 T14.D
N$61
  Bottom 0.508: R41.2 42.82,64.9 40.4,62.48 19.56,62.48 18.23,61.15 M2.J1.15
N$62
  Bottom 0.508: R41.1 57.91,64.9 58.8,65.79 58.8,66.8 59.69,67.69 LEDR1.A
N$63
  Bottom 0.508: M2.J1.13 25.11,61.47 42.67,61.47 JP4.1

### Text on the board
tPlace: INJECTORS ON | PNP | REV / LIMIT | INJECT. FET | FUEL / STATUS | NPN | PNP | Fuel / Controller | (+) (-) | INJECTORS | NPN | COIL BANK B | REV / LIMIT | PNP | AUX. FET | (+) (-) | AUXILIARY | WIRE | NPN | COIL BANK A | PNP | COIL B2 | Ignition / Controller | NPN | (+) (-) | COIL B2 FET | LM7805 | COIL B1 | LM7805 | (+) (-) | COIL B1 FET | A2 | +5V | GND | Fuel Injection and Ignition / Controller V1.1 | COIL A2 | IGNITION / STATUS | WIRE | (+) (-) | A1 | +5V | COIL A2 FET | GND | COIL A1 | (+) (-) | D17 | D18 | COILS / A1/A2 | COILS / B1/B2 | (S1) | (S2) | COIL A1 FET | A0 | +5V | Optical / Points | GND | (MAP) | (-) (+) | Power IN | Aux. Digital / Inputs